# Altium schematic sheet Sheet2.SchDoc
size A4
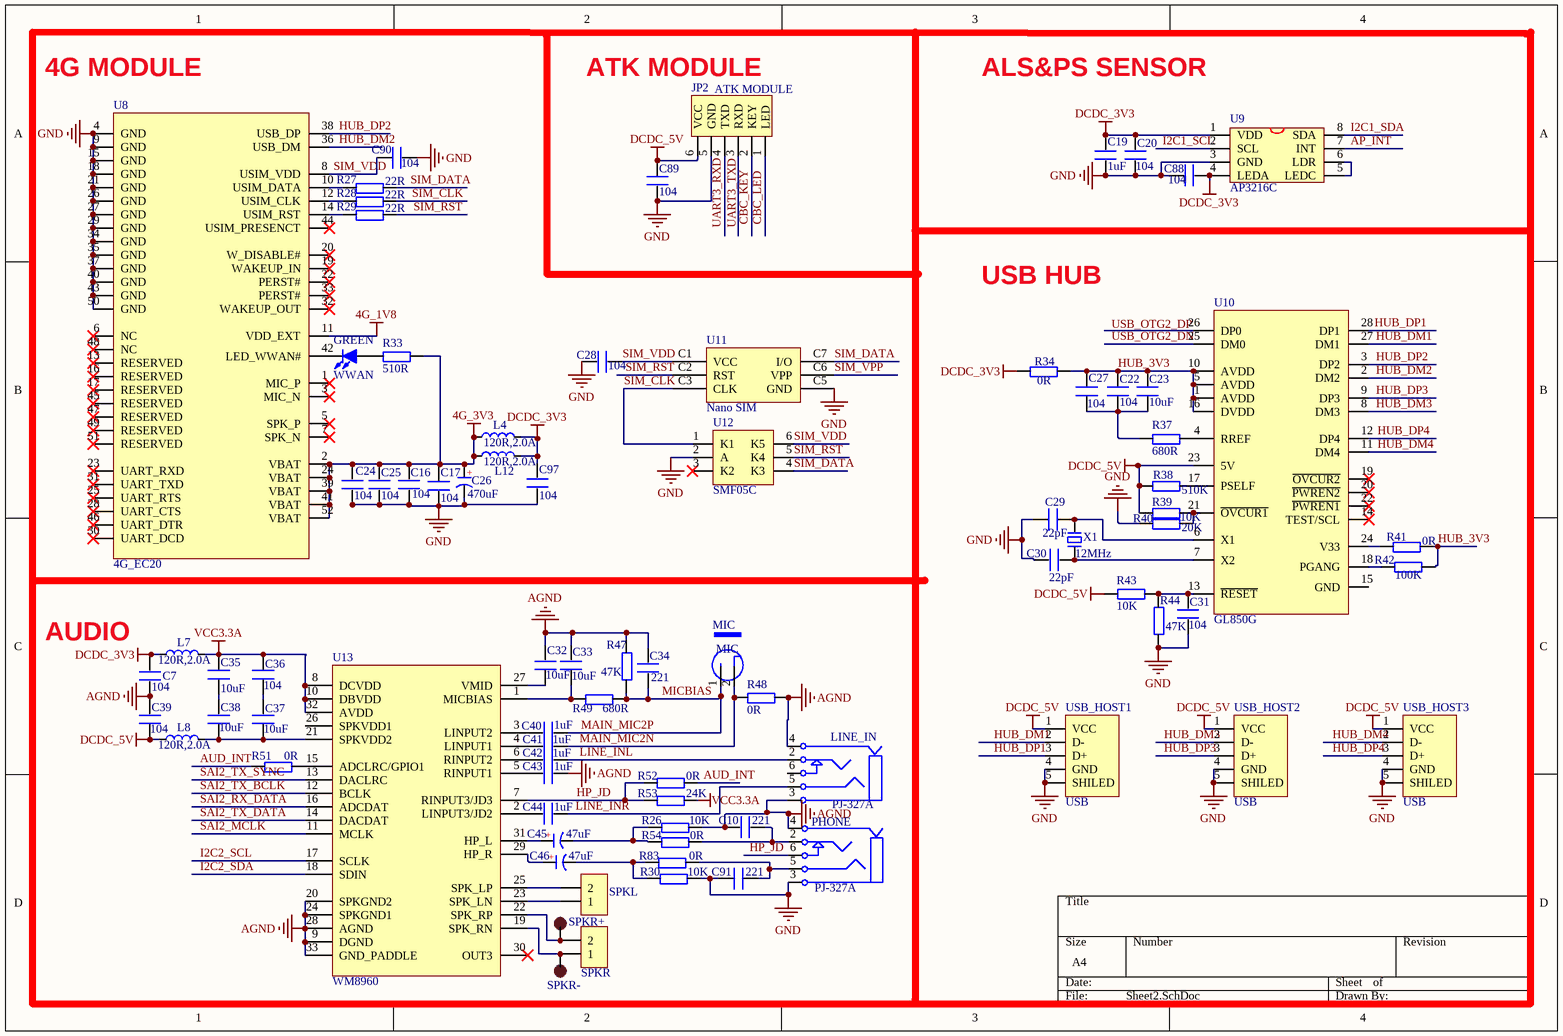
[diagram p0: Sheet2.SchDoc]

## Parts
C7  104  [C 0603]
C10  221  [C 0603]
C16  104  [C 0603]
C17  104  [C 0603]
C19  1uF  [C 0603]
C20  104  [C 0603]
C22  104  [C 0603]
C23  10uF  [C 0603]
C24  104  [C 0603]
C25  104  [C 0603]
C26  470uF  [CM D(6.3*5.4)]
C27  104  [C 0603]
C28  104  [C 0603]
C29  22pF  [C 0603]
C30  22pF  [C 0603]
C31  104  [C 0603]
C32  10uF  [C 0603]
C33  10uF  [C 0603]
C34  221  [C 0603]
C35  10uF  [C 0603]
C36  104  [C 0603]
C37  10uF  [C 0603]
C38  10uF  [C 0603]
C39  104  [C 0603]
C40  1uF  [C 0603]
C41  1uF  [C 0603]
C42  1uF  [C 0603]
C43  1uF  [C 0603]
C44  1uF  [C 0603]
C45  47uF  [CM D(6.3*5.4)]
C46  47uF  [CM D(6.3*5.4)]
C88  104  [C 0603]
C89  104  [C 0603]
C90  104  [C 0603]
C91  221  [C 0603]
C97  104  [C 0603]
GREEN  WWAN  [LED 0805R]
JP2  ATK MODULE  [HEAD6]
L4  120R,2.0A  [L 0603]
L7  120R,2.0A  [L 0603]
L8  120R,2.0A  [L 0603]
L12  120R,2.0A  [L 0603]
LINE_IN  PJ-327A  [PJ327A]
MIC  MIC  [MIC-6022]
PHONE  PJ-327A  [PJ327A]
R26  10K  [R 0603]
R27  22R  [R 0603]
R28  22R  [R 0603]
R29  22R  [R 0603]
R30  10K  [R 0603]
R33  510R  [R 0603]
R34  0R  [R 0603]
R37  680R  [R 0603]
R38  510K  [R 0603]
R39  10K  [R 0603]
R40  20K  [R 0603]
R41  0R  [R 0603]
R42  100K  [R 0603]
R43  10K  [R 0603]
R44  47K  [R 0603]
R47  47K  [R 0603]
R48  0R  [R 0603]
R49  680R  [R 0603]
R51  0R  [R 0603]
R52  0R  [R 0603]
R53  24K  [R 0603]
R54  0R  [R 0603]
R83  0R  [R 0603]
SPKL  SPKL  [XH2.54-2P_H]  (value not drawn)
SPKR  SPKL  [XH2.54-2P_H]  (value not drawn)
SPKR+  SPK+  [TP-1.5]  (value not drawn)
SPKR-  SPK+  [TP-1.5]  (value not drawn)
U8  4G_EC20  [Mini PCIE 52P]
U9  AP3216C  [QFN8]
U10  GL850G  [SSOP28_L]
U11  Nano SIM  [Nano SIM 7P]
U12  SMF05C  [SOT363-6L]
U13  WM8960  [QFN32 5x5_L]
USB_HOST1  USB  [USB-A/S_E]
USB_HOST2  USB  [USB-A/S_E]
USB_HOST3  USB  [USB-A/S_E]
X1  12MHz  [XTAL-49S DIP]

## Nets
4G_1V8: U8.11(VDD_EXT)
4G_3V3: C16.2 C17.2 C24.2 C25.2 C26.1(A) L4.1 L12.1 R33.2 U8.2(VBAT) U8.24(VBAT) U8.39(VBAT) U8.41(VBAT) U8.52(VBAT)
AGND: C7.1 C10.1 C32.1 C33.2 C34.2 C39.2 C43.2 LINE_IN.3 LINE_IN.4 PHONE.4 R26.2 R47.2 R48.2 U13.9(DGND) U13.20(SPKGND2) U13.24(SPKGND1) U13.28(AGND) U13.33(GND_PADDLE)
DCDC_3V3: C7.2 C19.2 C20.2 C88.1 C97.2 L4.2 L7.1 L12.2 R34.1 U9.1(VDD) U9.4(LEDA)
DCDC_5V: C39.1 C89.1 JP2.6(VCC) L8.1 R38.1 R39.1 R43.1 U10.23(5V) USB_HOST1.1(VCC) USB_HOST2.1(VCC) USB_HOST3.1(VCC)
GND: C16.1 C17.1 C19.1 C20.1 C24.1 C25.1 C26.2(K) C28.2 C29.2 C30.2 C31.2 C88.2 C89.2 C90.2 C91.1 C97.1 JP2.5(GND) PHONE.3 R30.2 R40.1 R44.1 U8.4(GND) U8.9(GND) U8.15(GND) U8.18(GND) U8.21(GND) U8.26(GND) U8.27(GND) U8.29(GND) U8.34(GND) U8.35(GND) U8.37(GND) U8.40(GND) U8.43(GND) U8.50(GND) U9.3(GND) U11.C5(GND) U12.2(A) USB_HOST1.4(GND) USB_HOST1.5(SHILED) USB_HOST2.4(GND) USB_HOST2.5(SHILED) USB_HOST3.4(GND) USB_HOST3.5(SHILED)
VCC3.3A: C35.2 C36.2 L7.2 R53.2 U13.8(DCVDD) U13.10(DBVDD) U13.32(AVDD)
AP_INT: U9.7(INT)
AUD_INT: R51.1 R52.2
CBC_KEY: JP2.2(KEY)
CBC_LED: JP2.1(LED)
HP_JD: PHONE.6 R52.1 R53.1 U13.7(RINPUT3/JD3)
HUB_3V3: C22.2 C23.2 C27.2 R34.2 R41.2 R42.2 U10.1(AVDD) U10.5(AVDD) U10.10(AVDD) U10.16(DVDD)
HUB_DM1: U10.27(DM1) USB_HOST1.2(D-)
HUB_DM2: U8.36(USB_DM) U10.2(DM2)
HUB_DM3: U10.8(DM3) USB_HOST2.2(D-)
HUB_DM4: U10.11(DM4) USB_HOST3.2(D-)
HUB_DP1: U10.28(DP1) USB_HOST1.3(D+)
HUB_DP2: U8.38(USB_DP) U10.3(DP2)
HUB_DP3: U10.9(DP3) USB_HOST2.3(D+)
HUB_DP4: U10.12(DP4) USB_HOST3.3(D+)
I2C1_SCL: U9.2(SCL)
I2C1_SDA: U9.8(SDA)
I2C2_SCL: U13.17(SCLK)
I2C2_SDA: U13.18(SDIN)
LINE_INL: C42.2 LINE_IN.2
LINE_INR: C44.2 LINE_IN.5
MAIN_MIC2N: C41.2 MIC.2(GND) R48.1
MAIN_MIC2P: C34.1 C40.2 MIC.1(VCC) R47.1 R49.2  [also labelled MICBIAS]
SAI2_MCLK: U13.11(MCLK)
SAI2_RX_DATA: U13.16(ADCDAT)
SAI2_TX_BCLK: U13.12(BCLK)
SAI2_TX_DATA: U13.14(DACDAT)
SAI2_TX_SYNC: U13.13(DACLRC)
SIM_CLK: R28.2 U11.C3(CLK) U12.1(K1)
SIM_DATA: R27.2 U11.C7(I/O) U12.4(K3)
SIM_RST: R29.2 U11.C2(RST) U12.5(K4)
SIM_VDD: C28.1 C90.1 U8.8(USIM_VDD) U11.C1(VCC) U12.6(K5)
SIM_VPP: U11.C6(VPP)
UART3_RXD: JP2.4(TXD)
USB_OTG2_DN: U10.25(DM0)
NetC10_2: C10.2 PHONE.2 R54.2
NetC22_1: C22.1 C23.1 C27.1 R37.1
NetC29_1: C29.1 U10.6(X1) X1.2
NetC30_1: C30.1 U10.7(X2) X1.1
NetC31_1: C31.1 R43.2 R44.2 U10.13(~{RESET})
NetC32_2: C32.2 U13.27(VMID)
NetC33_1: C33.1 R49.1 U13.1(MICBIAS)
NetC35_1: C35.1 C38.2
NetC36_1: C36.1 C37.2
NetC37_1: C37.1 C38.1 L8.2 U13.21(SPKVDD2)
NetC40_1: C40.1 U13.3(LINPUT2)
NetC41_1: C41.1 U13.4(LINPUT1)
NetC42_1: C42.1 U13.6(RINPUT2)
NetC43_1: C43.1 U13.5(RINPUT1)
NetC44_1: C44.1 U13.2(LINPUT3/JD2)
NetC45_1: C45.1(A) U13.31(HP_L)
NetC45_2: C45.2(K) R26.1 R54.1
NetC46_1: C46.1(A) U13.29(HP_R)
NetC46_2: C46.2(K) R30.1 R83.1
NetC91_2: C91.2 PHONE.5 R83.2
NetGREEN_1: GREEN.1(A) R33.1
NetGREEN_2: GREEN.2(K) U8.42(LED_WWAN#)
NetR27_1: R27.1 U8.10(USIM_DATA)
NetR28_1: R28.1 U8.12(USIM_CLK)
NetR29_1: R29.1 U8.14(USIM_RST)
NetR37_2: R37.2 U10.4(RREF)
NetR38_2: R38.2 U10.17(PSELF)
NetR39_2: R39.2 R40.2 U10.21(~{OVCUR1})
NetR41_1: R41.1 U10.24(V33)
NetR42_1: R42.1 U10.18(PGANG)
NetR51_2: R51.2 U13.15(ADCLRC/GPIO1)
NetSPKL_1: SPKL.1 U13.23(SPK_LN)
NetSPKL_2: SPKL.2 U13.25(SPK_LP)
NetSPKR_1: SPKR.1 SPKR-.1 U13.19(SPK_RN)
NetSPKR_2: SPKR.2 SPKR+.1 U13.22(SPK_RP)
NetU9_5: U9.5(LEDC) U9.6(LDR)

Not connected (* = marked no-connect by the designer): JP2 3(RXD); LINE_IN 6; U8 1(MIC_P)* 3(MIC_N)* 5(SPK_P)* 6(NC)* 7(SPK_N)* 13(RESERVED)* 16(RESERVED)* 17(RESERVED)* 19(WAKEUP_IN)* 20(W_DISABLE#)* 22(PERST#)* 23(UART_RXD)* 25(UART_RTS)* 28(UART_CTS)* 30(UART_DCD)* 31(UART_TXD)* 32(WAKEUP_OUT)* 33(PERST#)* 44(USIM_PRESENCT)* 45(RESERVED)* 46(UART_DTR)* 47(RESERVED)* 48(NC)* 49(RESERVED)* 51(RESERVED)*; U10 14(TEST/SCL)* 15(GND) 19(~{OVCUR2})* 20(~{PWREN2})* 22(~{PWREN1})* 26(DP0); U11 C4(NC); U12 3(K2)*; U13 26(SPKVDD1) 30(OUT3)*

## Notes on the sheet
- (near U8) 4G MODULE
- (near JP2) ATK MODULE
- ALS&PS SENSOR
- USB HUB
- AUDIO
- Labels drawn without touching a wire or pin: UART3_TXD, USB_OTG2_DP
- (in symbol C-CM) +

## Library data of the parts
C7 C10 C16 C17 C19 C20 C22-C25 C27-C44 C88-C91 C97 = C
C26 C45 C46 = C-CM: 贴片电解电容; 版权归属: 源创客; BOM名称: 贴片电解电容; 学习资源: www.ooocke.com
GREEN = LED-SMD: 贴片LED; 版权归属: 源创客; BOM名称: 贴片LED; 学习资源: www.ooocke.com
JP2 = ATK-HC05
L4 L7 L8 L12 = L: 小功率贴片电感磁珠; 版权归属: 源创客; BOM名称: 小功率贴片电感; 学习资源: www.ooocke.com
R26-R30 R33 R34 R37-R44 R47-R49 R51-R54 R83 = R
SPKL SPKR = Header 2: 2P接插件; 版权归属: 源创客; BOM名称: 2P接插件; 学习资源: www.ooocke.com
SPKR+ SPKR- = TEST-POINT: 测试点
U8 = 4G-EC20
U9 = AP3216C: ALS+PS Sensor
USB_HOST1-USB_HOST3 = USB-A/S: USB-A型母接口; 版权归属: 源创客; BOM名称: USB-A型母接口; 学习资源: www.ooocke.com
X1 = XTAL-2P: 2脚无源晶振; BOM名称: 2脚晶振; 版权归属: 源创客; 学习资源: www.ooocke.com